# EAGLE design 220_cup_wash_sucction (EAGLE 8.5.1)

## Sheet 1 of 3
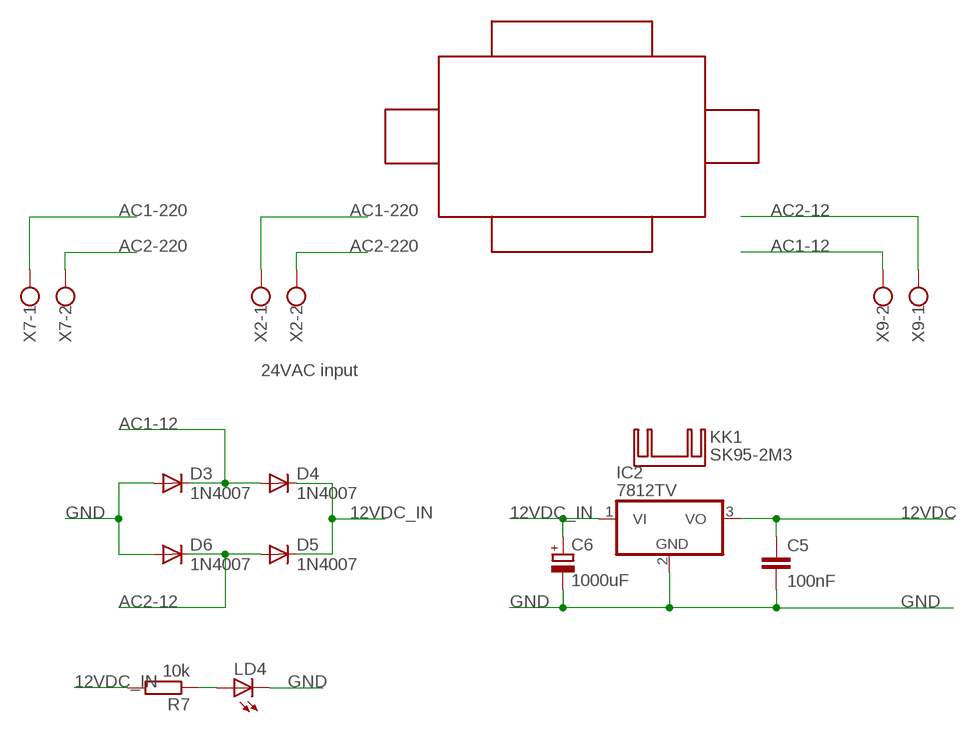
[diagram p0: schematic, sheet 1]

### Parts
C5  100nF  C-EU050-025X075  [C050-025X075]
C6  1000uF  CPOL-EUE3.5-10  [E3,5-10]
D3  1N4007  1N4004  [DO41-10]
D4  1N4007  1N4004  [DO41-10]
D5  1N4007  1N4004  [DO41-10]
D6  1N4007  1N4004  [DO41-10]
IC2  7812TV  [TO220V]
KK1  SK95-2M3  [SK95-2M3]
LD4  LED5MM  [LED5MM]
R7  10k  R-EU_0207/10  [0207/10]
U$1  TRANS_12V  [12V]
X2  W237-102  [W237-102]
X7  W237-102  [W237-102]
X9  W237-102  [W237-102]

### Nets
12VDC: C5.1 IC2.3(VO) ; also sheet 2
12VDC_IN: C6.+ D4.C D5.C IC2.1(VI) R7.2 ; also sheet 2,3
AC1-12: D3.C D4.A X9.2
AC1-220: X2.1 X7.1 ; also sheet 2,3
AC2-12: D5.A D6.C X9.1
AC2-220: X2.2 X7.2 ; also sheet 2,3
GND: C5.2 C6.- D3.A D6.A IC2.2(GND) LD4.K(C) ; also sheet 2,3
N$8: LD4.A R7.1

### Notes on the sheet
- 24VAC input

## Sheet 2 of 3
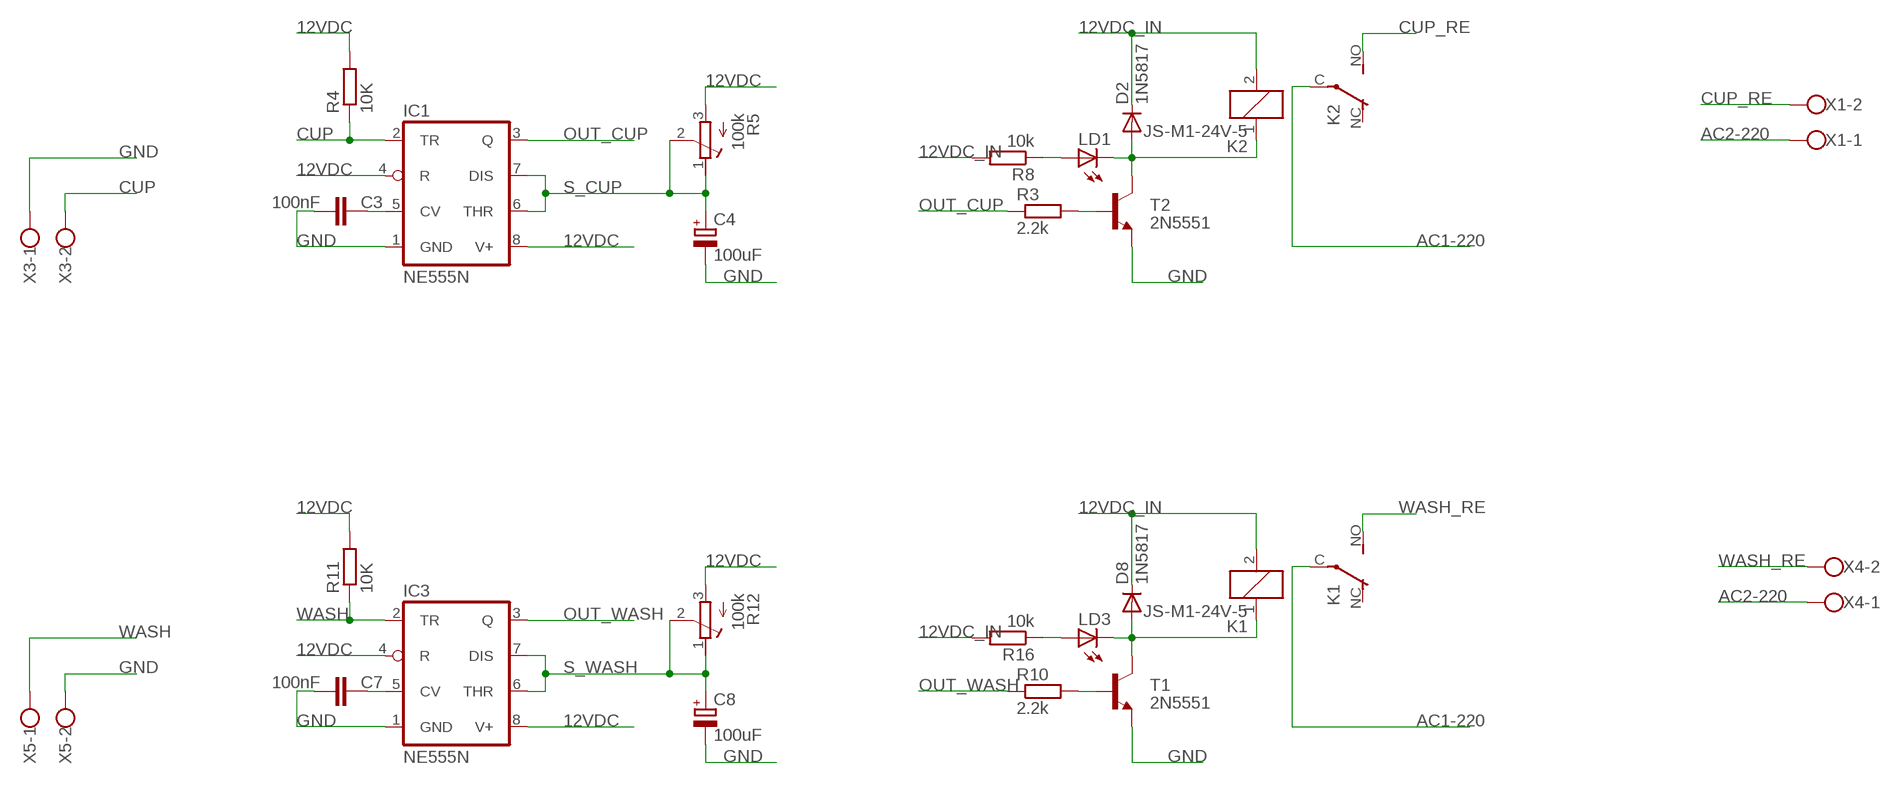
[diagram p1: schematic, sheet 2]

### Parts
C3  100nF  C-EU050-025X075  [C050-025X075]
C4  100uF  CPOL-EUE3.5-8  [E3,5-8]
C7  100nF  C-EU050-025X075  [C050-025X075]
C8  100uF  CPOL-EUE3.5-8  [E3,5-8]
D2  1N5817  1N4004  [DO41-10]
D8  1N5817  1N4004  [DO41-10]
IC1  NE555N  [DIL08-ROUND]
IC3  NE555N  [DIL08-ROUND]
K1  JS-M1-24V-5  JS-M1-12V-5  [JS-M]
K2  JS-M1-24V-5  JS-M1-12V-5  [JS-M]
LD1  LED5MM  [LED5MM]
LD3  LED5MM  [LED5MM]
R3  2.2k  R-EU_0207/10  [0207/10]
R4  10K  R-EU_0207/10  [0207/10]
R5  100k  R-TRIMMT93XA  [RTRIMT93XA]
R8  10k  R-EU_0207/10  [0207/10]
R10  2.2k  R-EU_0207/10  [0207/10]
R11  10K  R-EU_0207/10  [0207/10]
R12  100k  R-TRIMMT93XA  [RTRIMT93XA]
R16  10k  R-EU_0207/10  [0207/10]
T1  2N5551  2N2222  [TO92-EBC-OVAL]
T2  2N5551  2N2222  [TO92-EBC-OVAL]
X1  W237-102  [W237-102]
X3  W237-102  [W237-102]
X4  W237-102  [W237-102]
X5  W237-102  [W237-102]

### Nets
12VDC: IC1.4(R) IC1.8(V+) IC3.4(R) IC3.8(V+) R4.2 R5.3(A) R11.2 R12.3(A) ; also sheet 1
12VDC_IN: D2.C D8.C K1.2 K2.2 R8.2 R16.2 ; also sheet 1,3
AC1-220: K1.C(2:P) K2.C(2:P) ; also sheet 1,3
AC2-220: X1.1 X4.1 ; also sheet 1,3
CUP: IC1.2(TR) R4.1 X3.2
CUP_RE: K2.NO(2:S) X1.2
GND: C3.2 C4.- C7.2 C8.- IC1.1(GND) IC3.1(GND) T1.E T2.E X3.1 X5.2 ; also sheet 1,3
N$1: R3.2 T2.B
N$2: C3.1 IC1.5(CV)
N$3: D2.A K2.1 LD1.K(C) T2.C
N$5: C7.1 IC3.5(CV)
N$6: LD1.A R8.1
N$11: D8.A K1.1 LD3.K(C) T1.C
N$12: R10.2 T1.B
N$14: LD3.A R16.1
OUT_CUP: IC1.3(Q) R3.1
OUT_WASH: IC3.3(Q) R10.1
S_CUP: C4.+ IC1.6(THR) IC1.7(DIS) R5.1(E) R5.2(S)
S_WASH: C8.+ IC3.6(THR) IC3.7(DIS) R12.1(E) R12.2(S)
WASH: IC3.2(TR) R11.1 X5.1
WASH_RE: K1.NO(2:S) X4.2
Unconnected: K1.NC(2:O) K2.NC(2:O)

## Sheet 3 of 3
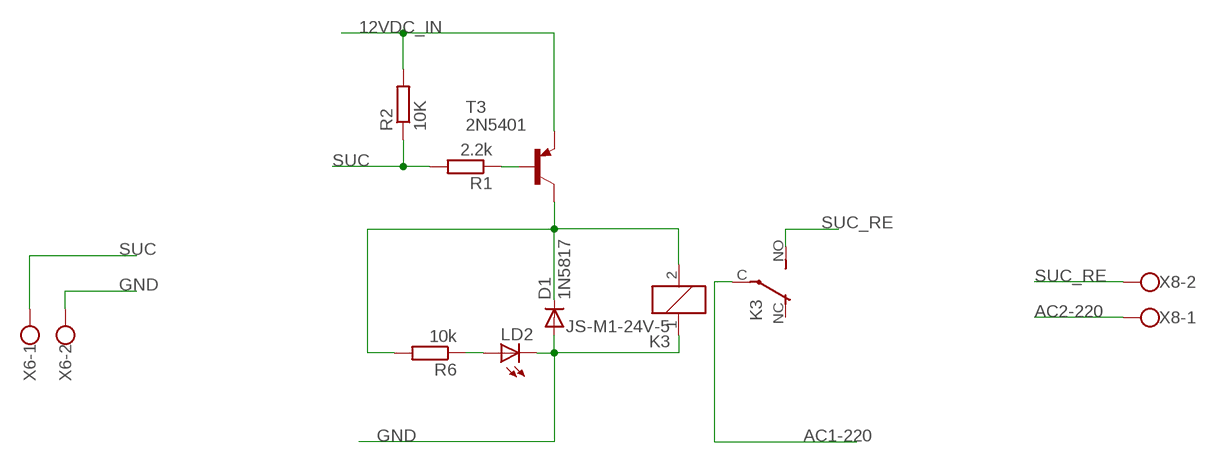
[diagram p2: schematic, sheet 3]

### Parts
D1  1N5817  1N4004  [DO41-10]
K3  JS-M1-24V-5  JS-M1-12V-5  [JS-M]
LD2  LED5MM  [LED5MM]
R1  2.2k  R-EU_0207/10  [0207/10]
R2  10K  R-EU_0207/10  [0207/10]
R6  10k  R-EU_0207/10  [0207/10]
T3  2N5401  2N5401-PNP-TO92-EBC  [TO92-EBC]
X6  W237-102  [W237-102]
X8  W237-102  [W237-102]

### Nets
12VDC_IN: R2.2 T3.E ; also sheet 1,2
AC1-220: K3.C(2:P) ; also sheet 1,2
AC2-220: X8.1 ; also sheet 1,2
GND: D1.A K3.1 LD2.K(C) X6.2 ; also sheet 1,2
N$7: R1.1 T3.B
N$9: LD2.A R6.1
NS1: D1.C K3.2 R6.2 T3.C
SUC: R1.2 R2.1 X6.1
SUC_RE: K3.NO(2:S) X8.2
Unconnected: K3.NC(2:O)

## Library data of the parts
C3 C5 C7 = rcl:C-EU: CAPACITOR, European symbol; SPICEPREFIX: C
C4 C6 C8 = rcl:CPOL-EU: POLARIZED CAPACITOR, European symbol; SPICEPREFIX: C
D1-D6 D8 = adafruit:1N4004: DIODE General purpose 1N400x type rectifier (With bigger pads) http://www.ladyada.net/library/pcb/eaglelibrary.html
IC1 IC3 = adafruit:*555: TIMER Changed DIP package to have round (not oval) pin pads http://www.ladyada.net/library/pcb/eaglelibrary.html
IC2 = linear:78*: Positive VOLTAGE REGULATOR Source: http://cache.national.com/ds/LM/LM78L05.pdf http://www.fairchildsemi.com/ds/LM/LM7805.pdf
K1-K3 = relay:JS-M1*: Automotive Ultra-Miniature Power Relay NAiS Source: http://www.mew-europe.com/.. en_ds_61211_0000.pdf; MF: FARNELL; MPN: JSM1-12V-5; OC_FARNELL: 910351; OC_NEWARK: 14J1764
KK1 = heatsink:SK95-2M3: HEATSINK manufacturer Fischer/distributor Buerklin
LD1-LD4 = led:LED: LED OSRAM: - CHIPLED LG R971, LG N971, LY N971, LG Q971, LY Q971, LO R971, LY R971 LH N974, LH R974 LS Q976, LO Q976, LY Q976 LO Q996 - Hyper CHIPLED LW Q18S LB Q993, LB Q99A, LB R99A - SideLED LS A670, LO A670, LY A670, LG A670, LP A670 LB A673, LV A673, LT A673, LW A673 LH A674 LY A675 LS A676, LA A676, LO A676, LY A676, LW A676 LS A679, LY A679, LG A679 - Hyper Micro SIDELED® LS Y876, LA Y876, LO Y876, LY Y876 LT Y87S - SmartLED LW L88C, LW L88S LB L89C, LB L89S, LG L890 LS L89K, LO L89K, LY L89K LS L896, LA L896, LO L896, LY L896 - TOPLED LS T670, LO T670, LY T670, LG T670, LP T670 LSG T670, LSP T670, LSY T670, LOP T670, LYG T670 LG T671, LOG T671, LSG T671 LB T673, LV T673, LT T673, LW T673 LH T674 LS T676, LA T676, LO T676, LY T676, LB T676, LH T676, LSB T676, LW T676 LB T67C, LV T67C, LT T67C, LS T67K, LO T67K, LY T67K, LW E67C LS E67B, LA E67B, LO E67B, LY E67B, LB E67C, LV E67C, LT E67C LW T67C LS T679, LY T679, LG T679 LS T770, LO T770, LY T770, LG T770, LP T770 LB T773, LV T773, LT T773, LW T773 LH T774 LS E675, LA E675, LY E675, LS T675 LS T776, LA T776, LO T776, LY T776, LB T776 LHGB T686 LT T68C, LB T68C - Hyper Mini TOPLED® LB M676 - Mini TOPLED Santana® LG M470 LS M47K, LO M47K, LY M47K Source: http://www.osram.convergy.de/
R1-R4 R6-R8 R10 R11 R16 = rcl-2:R-EU_: RESISTOR, European symbol
R5 R12 = rcl:R-TRIMM: Trimm resistor; SPICEMODEL: X; SPICEPREFIXL: POT
T1 T2 = adafruit:2N2222: NPN TRANSISTOR Big oval pads
T3 = transistor-neu-to92:*-PNP-: PNP Transistror
U$1 = transformer12v:TRANS_12V
X1-X9 = con-wago-500:W237-102: WAGO SCREW CLAMP

## Board
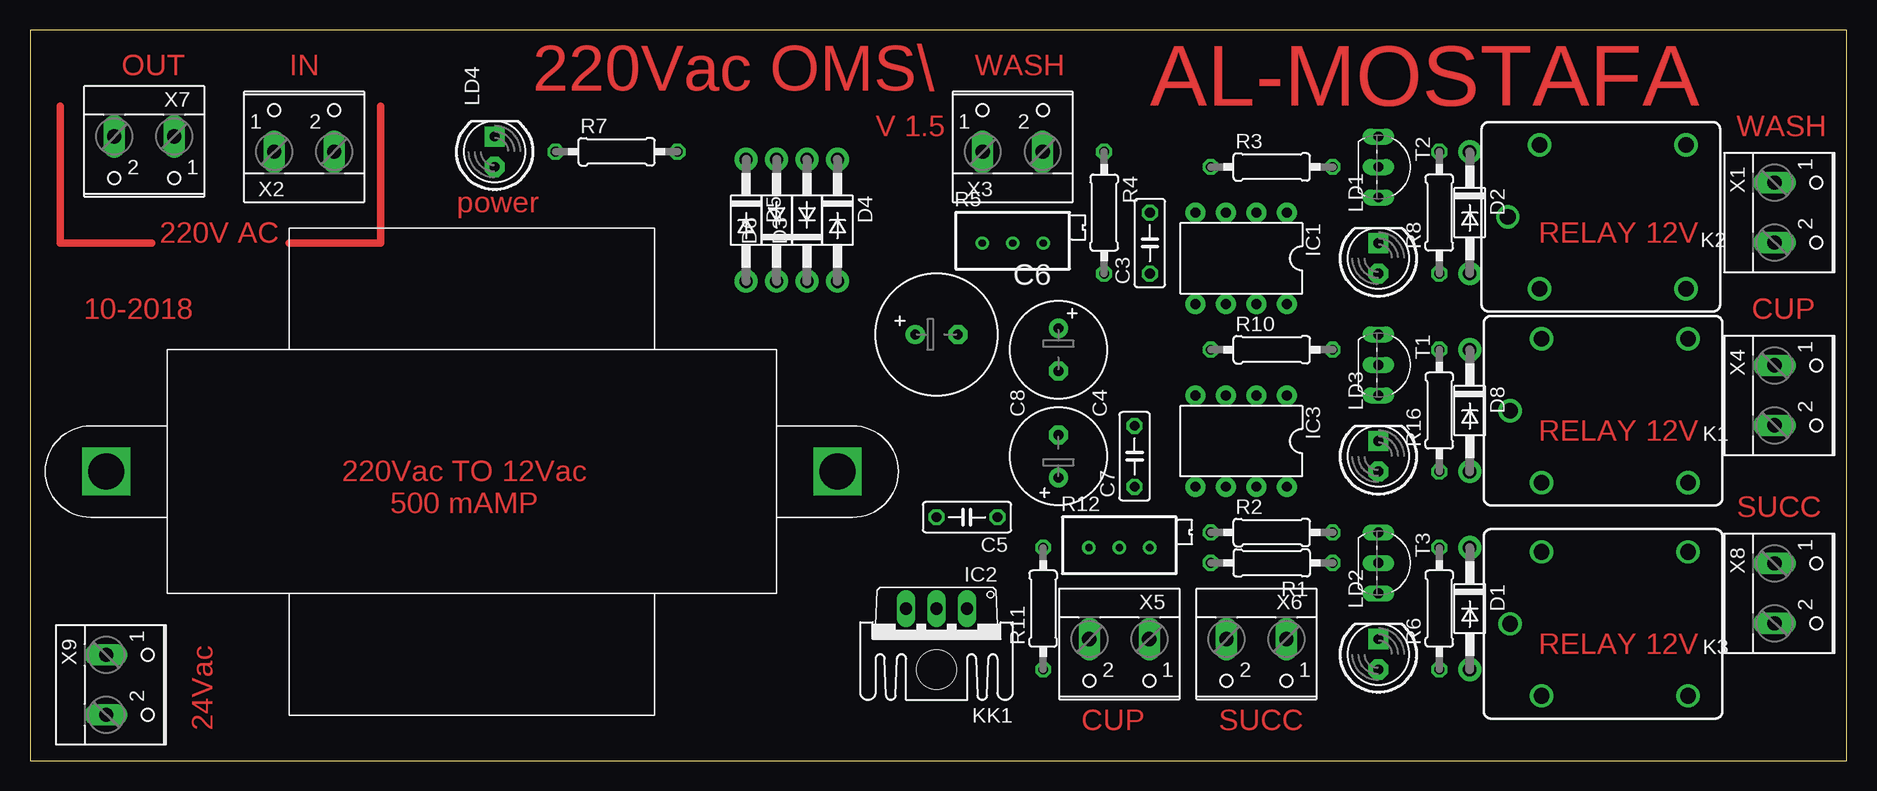
[diagram p3: board, top side]
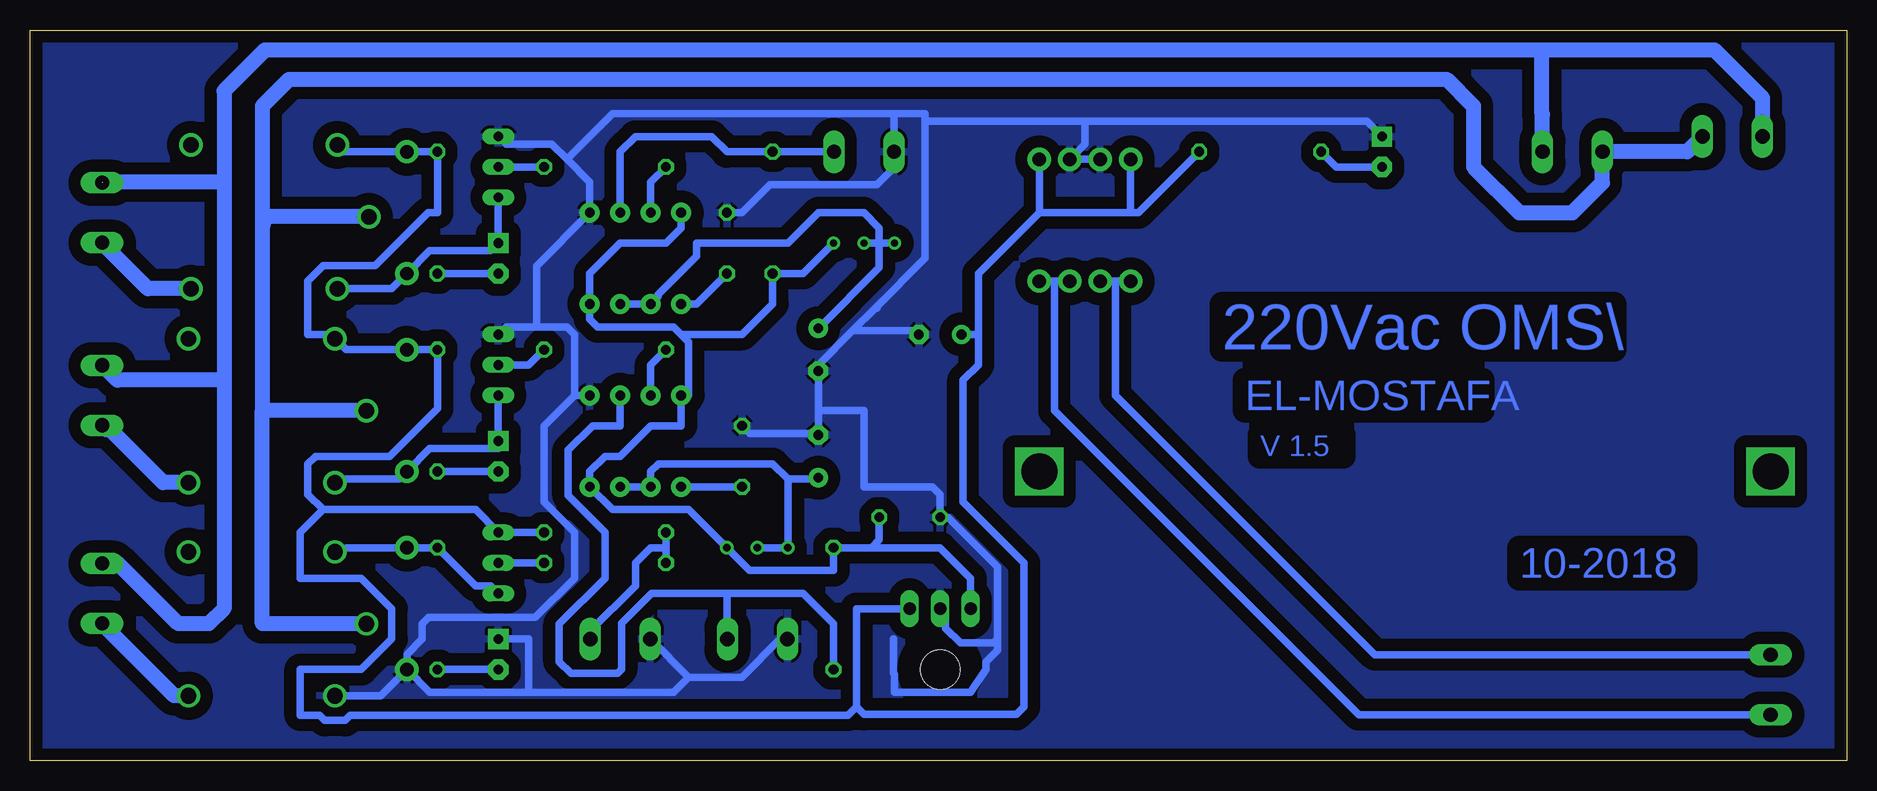
[diagram p4: board, bottom side, seen from below]

Size 151.44 x 60.95 mm. Coordinates in mm from the lower left corner, seen from the top.
Outline: 0,0 151.44,0 151.44,60.95 0,60.95 0,0
Copper layers (1*16): Top 0.035mm / dielectric 1.5mm / Bottom 0.035mm
Design rules "default *": minimum track width 25mil, minimum drill 0.35mm, track to track 40mil, track to pad 40mil, pad to pad 6mil, via to via 6mil, smd to smd 6mil, copper to edge 40mil, drill to drill 6mil, minimum pad ring 10mil, minimum via ring 8mil, stop-mask expansion 4mil, vias tented up to drill 0mil, thermal gap 10mil

### Footprints (pad centres in the part's own frame; a part is rotated, then mirrored left to right if it is on the bottom)
C050-025X075 = drill 0.813 octagon: 1 -2.54,0; 2 2.54,0
E3,5-8 = drill 0.813 pad 1.6: + -1.778,0 | drill 0.813 pad 1.6 octagon: - 1.778,0
E3,5-10 = drill 0.813 pad 1.6: + -1.778,0 | drill 0.813 pad 1.6 octagon: - 1.778,0
DO41-10 = drill 1.118 pad 1.93: A 5.08,0; C -5.08,0
DIL08-ROUND = drill 0.813 pad 1.676: 1 -3.81,-3.81; 2 -1.27,-3.81; 3 1.27,-3.81; 4 3.81,-3.81; 5 3.81,3.81; 6 1.27,3.81; 7 -1.27,3.81; 8 -3.81,3.81
TO220V = drill 1.016 long: 1 -2.54,-2.54; 2 0,-2.54; 3 2.54,-2.54
JS-M = drill 1.3: 1 6.7,6; 2 6.7,-6; C 9.335,0; NC -5.5,-6; NO -5.5,6
SK95-2M3 = hole 3.302: 0,2.54
LED5MM = drill 0.813 pad 1.676 octagon: A -1.27,0 | drill 0.813 pad 1.676 square: K 1.27,0
0207/10 = drill 0.813 octagon: 1 -5.08,0; 2 5.08,0
RTRIMT93XA = drill 0.61: 1 0,-2.54; 2 0,0; 3 0,2.54
TO92-EBC-OVAL = drill 0.813 long: B 0,-1.27; C 2.54,-1.27; E -2.54,-1.27
TO92-EBC = drill 0.813 long: B 0,-1.27; C 2.54,-1.27; E -2.54,-1.27
12V = drill 3 square: P$1 -29.21,0; P$2 31.75,0
W237-102 = drill 1.194 long: 1 -2.5,-1.27; 2 2.5,-1.27

### Placement (x,y rotation side)
C3  93.34,43.18 90 top
C4  85.72,34.29 270 top
C5  78.1,20.32 180 top
C6  75.56,35.56 0 top
C7  92.07,25.4 90 top
C8  85.72,25.4 90 top
D1  120.01,12.7 270 top
D2  120.01,45.72 270 top
D3  64.77,45.09 90 top
D4  67.31,45.09 270 top
D5  59.69,45.09 270 top
D6  62.23,45.09 90 top
D8  120.01,29.21 270 top
IC1  100.97,41.91 180 top
IC2  75.56,10.16 180 top
IC3  100.97,26.67 180 top
K1  132.72,29.21 180 top
K2  132.53,45.37 180 top
K3  132.72,11.43 180 top
KK1  75.56,10.16 180 top
LD1  112.4,41.91 90 top
LD2  112.4,8.89 90 top
LD3  112.4,25.4 90 top
LD4  38.73,50.8 90 top
R1  103.5,16.51 180 top
R2  103.5,19.05 0 top
R3  103.5,49.53 0 top
R4  89.53,45.72 270 top
R5  81.91,43.18 270 top
R6  117.47,12.7 90 top
R7  48.89,50.8 0 top
R8  117.47,45.72 90 top
R10  103.5,34.29 0 top
R11  84.45,12.7 90 top
R12  90.81,17.78 270 top
R16  117.47,29.21 90 top
T1  113.66,33.02 270 top
T2  113.66,49.53 270 top
T3  113.66,16.51 270 top
U$1  35.56,24.13 0 top
X1  146.69,45.72 270 top
X2  22.86,52.07 0 top
X3  81.91,52.07 0 top
X4  146.69,30.48 270 top
X5  90.81,8.89 180 top
X6  102.23,8.89 180 top
X7  9.52,50.8 180 top
X8  146.69,13.97 270 top
X9  7.62,6.35 270 top

### Tracks (layer width: path | path; a pad name or v marks a point on that pad's centre or on a via)
12VDC
  Bottom 0.635: 97.16,35.56 96.52,34.92 96.52,30.48 IC3.4 97.16,27.94 99.69,27.94 102.23,25.4 103.5,25.4 104.78,24.13 IC3.8 102.87,20.95 96.52,20.95 R12.3 91.44,15.88 84.45,15.88 R11.2 81.28,17.78 | 97.16,35.56 97.79,36.2 104.14,36.2 104.78,36.83 IC1.8 104.78,40.64 102.23,43.18 98.42,43.18 97.16,44.45 IC1.4 | IC2.3 73.03,15.24 75.56,17.78 81.28,17.78 | R5.3 87,40.64 R4.2 89.53,38.1 92.07,35.56 97.16,35.56 | C5.1 80.64,18.41 81.28,17.78
12VDC_IN
  Bottom 0.635: K2.2 125.73,50.8 D2.C R8.2 117.47,45.72 118.24,45.72 122.66,41.3 126.98,41.3 128.27,40.01 128.27,35.56 126.37,35.56 K1.2 125.09,34.29 D8.C R16.2 117.47,29.38 121.46,25.4 127.63,25.4 128.27,24.76 128.27,22.22 127,20.95 | R2.2 T3.E 114.3,20.95 127,20.95 | 82.55,4.51 82.55,12.7 IC2.1 | 82.55,4.51 81.91,3.87 69.22,3.87 68.58,4.51 68.58,16.51 73.66,21.59 73.66,31.75 72.39,33.02 72.39,35.56 | 82.55,4.51 83.25,3.81 124.73,3.81 125.16,3.38 126.87,3.38 127.3,3.81 128.91,3.81 128.91,7.62 123.82,7.62 121.28,10.16 121.28,12.7 123.82,15.24 128.91,15.24 128.91,19.05 127,20.95 | D5.C 59.69,45.72 | 67.31,45.72 59.69,45.72 | D4.C 67.31,45.72 | 67.31,45.72 72.39,40.64 72.39,35.56 | C6.+ 72.39,35.56 | 59.69,45.72 59.05,45.72 R7.2
AC1-12
  Bottom 0.635: D3.C 66.04,40.01 | 66.04,40.01 D4.A 67.31,39.37 | X9.2 40.68,3.85 66.04,29.21 66.04,40.01
AC1-220
  Bottom 1.27: 132.08,44.45 132.08,29.21 | 132.08,29.21 132.08,11.43 K3.C | K1.C 132.08,29.21 | 132.08,44.45 131.79,45.37 K2.C | 132.08,44.45 132.08,54.61 129.84,56.84 33.35,56.84 31.11,54.61 31.11,49.53 27.3,45.72 22.86,45.72 20.36,48.22 X2.1 13.29,50.8 X7.1
AC2-12
  Bottom 0.635: D6.C 60.96,40.01 | 60.96,40.01 D5.A | X9.1 39.33,8.85 60.96,30.48 60.96,40.01
AC2-220  (1 unrouted)
  Bottom 0.635: 145.41,16.51 X8.1 | 145.41,32.38 X4.1 | 145.41,47.62 X1.1
  Bottom 1.27: 135.25,48.26 135.25,31.75 | 135.25,31.75 135.25,12.7 136.53,11.43 139.06,11.43 144.15,16.51 145.41,16.51 | X4.1 145.41,33.02 144.15,31.75 135.25,31.75 | 135.25,48.26 145.41,48.26 | 135.25,48.26 135.25,55.88 131.84,59.3 25.4,59.3 | 25.4,59.3 11.04,59.3 7.02,55.29 X7.2 | X2.2 25.36,53.9 25.4,53.94 25.4,59.3
CUP
  Bottom 0.635: IC1.2 102.23,50.8 100.97,52.07 94.61,52.07 93.34,50.8 R4.1 X3.2
CUP_RE
  Bottom 0.635: 145.41,43.18 X1.2
  Bottom 1.27: K2.NO 141.6,39.37 145.41,43.18
GND
  Bottom 0.635: 96.52,6.98 92.07,6.98 88.9,10.16 X5.2 | 96.52,6.98 99.69,10.16 X6.2 | D1.A 118.11,5.71 109.85,5.71 | T2.E 111.76,51.44 107.95,51.44 106.68,50.16 | 106.68,50.16 104.78,48.26 IC1.1 109.22,41.28 109.22,36.2 | D6.A D3.A 63.5,51.44 63.5,53.34 | C7.2 91.44,27.3 85.72,27.3 | 85.72,27.3 85.72,29.21 | 85.72,29.21 C4.- 85.72,33.02 82.87,35.88 | 85.72,27.3 C8.- | 85.72,29.21 81.91,29.21 81.91,22.86 76.2,22.86 75.56,22.22 C5.2 74.93,20.32 70.8,16.19 70.8,10.16 | 106.68,50.16 102.87,53.98 79.38,53.98 | 79.38,53.98 76.84,53.98 76.84,53.34 | 76.84,53.34 76.84,41.91 80.96,37.78 | 79.38,53.98 79.41,53.94 X3.1 79.41,49.57 79.38,49.53 80.85,48.06 89.74,48.06 92.07,45.72 C3.2 | 106.04,30.48 108.59,27.94 108.59,21.59 106.04,19.05 106.04,15.24 109.33,11.95 118.22,11.95 118.75,11.43 118.75,10.16 120.01,8.89 D1.A | 106.04,30.48 IC3.1 | K3.1 122.2,5.43 D1.A | 96.52,6.98 97.79,5.71 109.85,5.71 | LD2.K 109.85,10.16 109.85,5.71 | 109.22,36.2 106.68,36.2 106.04,35.56 106.04,30.48 | 109.22,36.2 111.76,36.2 T1.E | 79.44,10.16 79.44,7.29 79.38,7.22 79.38,5.71 73.03,5.71 71.75,7.62 71.75,8.26 70.8,9.21 70.8,10.16 | 80.96,37.78 82.87,35.88 | IC2.2 75.12,12.26 75.12,11.07 73.89,9.84 71.12,9.84 70.8,10.16 | 80.84,37.78 80.96,37.78 | 63.5,53.34 76.84,53.34 | LD4.K 40,53.34 63.5,53.34 | C6.- 77.66,35.88 82.87,35.88
  pour Bottom: 0,60.96 151.13,60.96 151.13,0 0,0
N$1
  Bottom 0.635: R3.2 T2.B
N$2
  Bottom 0.635: C3.1 95.88,38.1 IC1.5
N$3
  Bottom 0.635: T2.C LD1.K 113.03,42.55 118.11,42.55 D2.A 121.28,39.37 K2.1
N$4
  Top 0.635: 21.59,43.18 29.21,43.18 29.21,54.61
N$5
  Bottom 0.635: IC3.5 C7.1
N$6
  Bottom 0.635: LD1.A R8.1
N$7
  Bottom 0.635: T3.B R1.1
N$8
  Bottom 0.635: R7.1 42.54,49.53 LD4.A
N$9
  Bottom 0.635: LD2.A R6.1
N$10
  Top 0.635: 10.16,43.18 2.54,43.18 2.54,54.61
N$11
  Bottom 0.635: T1.C LD3.K 112.4,26.04 118.11,26.04 D8.A 120.65,23.49 125.73,23.49 K1.1
N$12
  Bottom 0.635: R10.2 109.85,33.02 T1.B
N$14
  Bottom 0.635: LD3.A R16.1
NS1
  Bottom 0.635: T3.C 113.03,14.61 114.3,14.61 R6.2 D1.C 125.09,17.78 K3.2
OUT_CUP
  Bottom 0.635: R3.1 99.69,48.26 IC1.3
OUT_WASH
  Bottom 0.635: IC3.3 99.69,33.02 R10.1
S_CUP
  Bottom 0.635: IC1.7 IC1.6 99.07,38.72 99.07,38.89 95.88,42.08 95.88,43.18 88.27,43.18 85.72,45.72 81.91,45.72 80.64,44.45 80.64,43.18 | 80.64,43.18 R5.2 | R5.1 80.64,43.18 | 80.64,43.18 80.64,41.15 C4.+
S_WASH
  Bottom 0.635: IC3.7 IC3.6 99.69,24.13 99.06,24.76 89.53,24.76 88.27,23.49 | R12.2 R12.1 88.27,23.49 | 88.27,23.49 85.72,23.49 C8.+
SUC
  Bottom 0.635: R2.1 98.42,17.78 | 98.42,17.78 R1.2 | 98.42,17.78 99.69,17.78 100.97,16.51 100.97,14.59 104.78,10.78 104.78,10.16 X6.1
SUC_RE
  Bottom 0.635: 145.41,11.43 X8.2
  Bottom 1.27: K3.NO 139.41,5.43 145.41,11.43
WASH
  Bottom 0.635: R11.1 84.45,11.43 87,13.97 93.34,13.97 | 93.31,11.47 X5.1 93.34,10.2 93.34,13.97 | IC3.2 102.23,27.94 104.55,27.94 106.57,25.92 106.57,22.12 106.04,21.6 106.04,21.59 103.5,19.05 103.5,15.24 107.31,11.43 107.31,8.26 106.35,7.29 102.46,7.29 102.13,7.62 102.13,11.46 99.61,13.97 93.34,13.97
WASH_RE
  Bottom 0.635: 145.41,27.94 X4.2
  Bottom 1.27: 145.41,27.94 145.1,27.62 144.76,27.62 140.34,23.21 K1.NO

### Text on the board
Top: OUT | IN | WASH | 220Vac OMS\ | AL-MOSTAFA | V 1.5 | WASH | power | 220V AC | RELAY 12V | 10-2018 | CUP | RELAY 12V | 220Vac TO 12Vac / 500 mAMP | SUCC | RELAY 12V | 24Vac | CUP | SUCC
Bottom: 220Vac OMS\ | EL-MOSTAFA | V 1.5 | 10-2018